# Altium schematic sheet MCU176.SchDoc
size A2
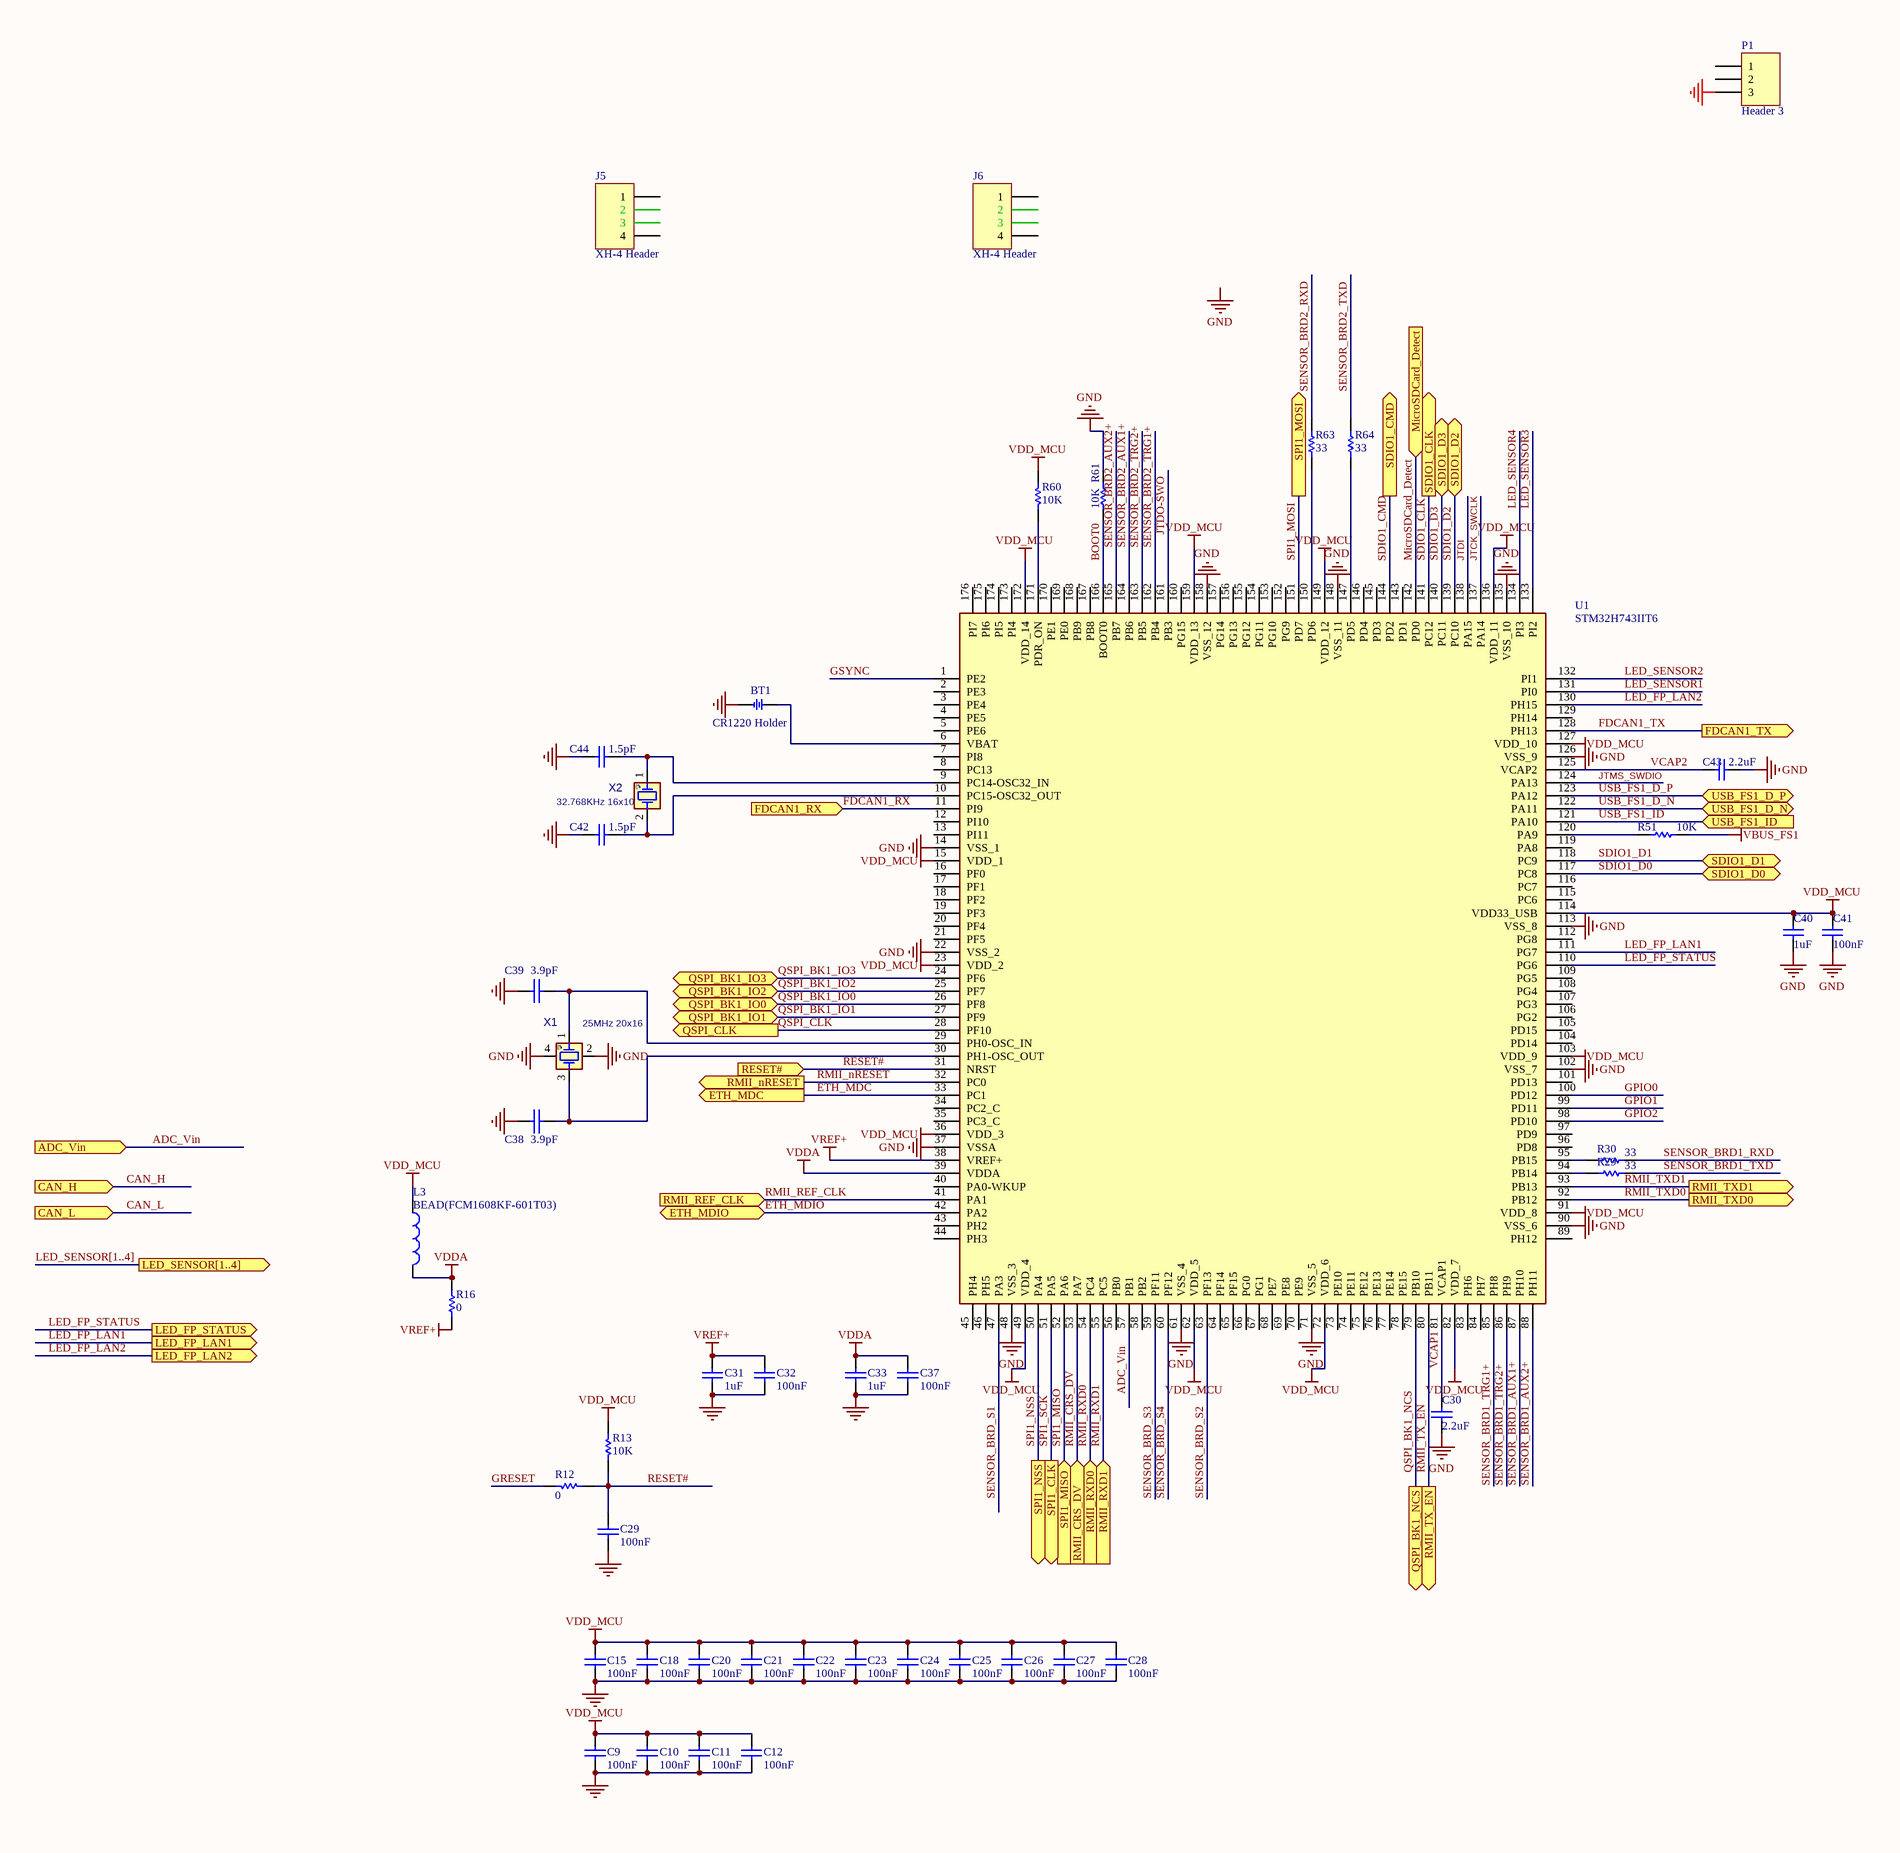
[diagram p0: MCU176.SchDoc, left]
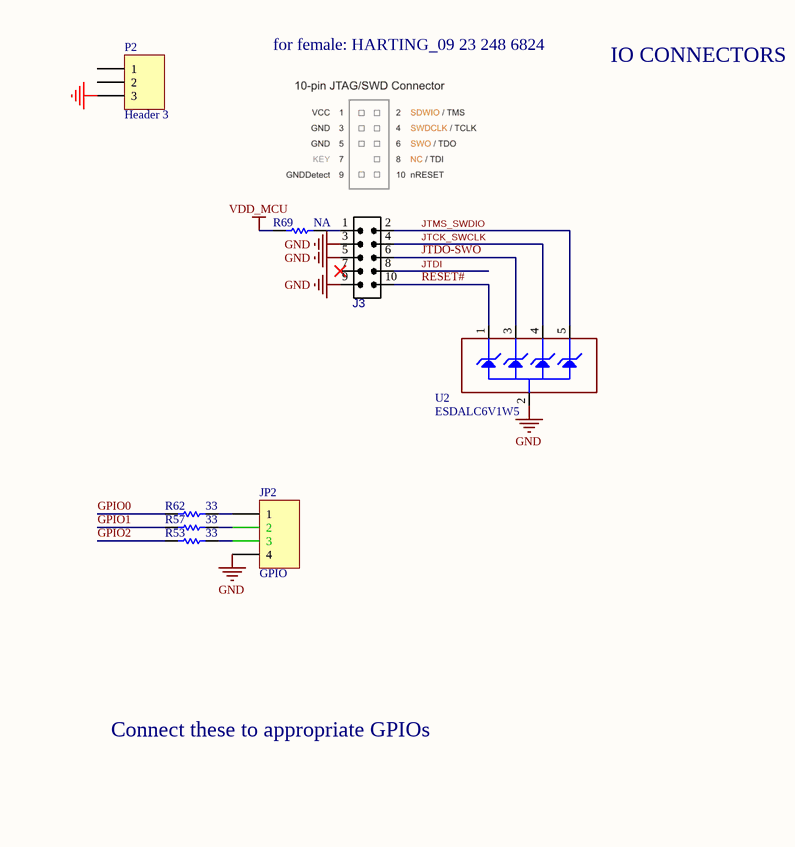
[diagram p1: MCU176.SchDoc, right]

## Parts
BT1  CR1220 Holder  [BTH1220]
C9  100nF  [C0603]
C10  100nF  [C0603]
C11  100nF  [C0603]
C12  100nF  [C0603]
C15  100nF  [C0603]
C18  100nF  [C0603]
C20  100nF  [C0603]
C21  100nF  [C0603]
C22  100nF  [C0603]
C23  100nF  [C0603]
C24  100nF  [C0603]
C25  100nF  [C0603]
C26  100nF  [C0603]
C27  100nF  [C0603]
C28  100nF  [C0603]
C29  100nF  [C0603]
C30  2.2uF  [C0603]
C31  1uF  [C0603]
C32  100nF  [C0603]
C33  1uF  [C0603]
C37  100nF  [C0603]
C38  3.9pF  [C0603]
C39  3.9pF  [C0603]
C40  1uF  [C0603]
C41  100nF  [C0603]
C42  1.5pF  [C0603]
C43  2.2uF  [C0603]
C44  1.5pF  [C0603]
J3  IDC_2X5  [IDC_2X5]  (value not drawn)
J5  XH-4 Header  [XH-4]
J6  XH-4 Header  [XH-4]
JP2  GPIO  [XH-4]
L3  BEAD(FCM1608KF-601T03)  [L0603E]
P1  Header 3  [xh-3]
P2  Header 3  [xh-3]
R12  0  [R0603]
R13  10K  [R0603]
R16  0  [R0603]
R29  33  [R0603]
R30  33  [R0603]
R51  10K  [R0603]
R53  33  [R0603]
R57  33  [R0603]
R60  10K  [R0603]
R61  10K  [R0603]
R62  33  [R0603]
R63  33  [R0603]
R64  33  [R0603]
R69  NA  [R0603]  (no BOM)
U1  STM32H743IIT6  [QFP50P2600X2600X160-176N]
U2  ESDALC6V1W5  [SOT65P210X110-5N]
X1  25MHz 20x16  [XTL_4_2016]
X2  32.768KHz 16x10  [XTL_2_1610]

## Ports
ADC_Vin (in), CAN_H (in), CAN_L (in), ETH_MDC (out), ETH_MDIO (bidir), FDCAN1_RX (in), FDCAN1_TX (out), LED_FP_LAN1 (out), LED_FP_LAN2 (out), LED_FP_STATUS (out), LED_SENSOR[1..4] (out), MicroSDCard_Detect (in), QSPI_BK1_IO0 (bidir), QSPI_BK1_IO1 (bidir), QSPI_BK1_IO2 (bidir), QSPI_BK1_IO3 (bidir), QSPI_BK1_NCS (out), QSPI_CLK (out), RESET# (in), RMII_CRS_DV (in), RMII_nRESET (out), RMII_REF_CLK (in), RMII_RXD0 (in), RMII_RXD1 (in), RMII_TX_EN (out), RMII_TXD0 (out), RMII_TXD1 (out), SDIO1_CLK (out), SDIO1_CMD (out), SDIO1_D0 (bidir), SDIO1_D1 (bidir), SDIO1_D2 (bidir), SDIO1_D3 (bidir), SPI1_CLK (out), SPI1_MISO (in), SPI1_MOSI (out), SPI1_NSS (out), USB_FS1_D_N (bidir), USB_FS1_D_P (bidir), USB_FS1_ID (in)

## Nets
GND: BT1.2 C9.2 C10.2 C11.2 C12.2 C15.2 C18.2 C20.2 C21.2 C22.2 C23.2 C24.2 C25.2 C26.2 C27.2 C28.2 C29.1 C30.1 C31.1 C32.1 C33.1 C37.1 C38.2 C39.2 C40.1 C41.1 C42.2 C43.2 C44.2 J3.3 J3.5 J3.9 JP2.4 P1.3 P2.3 R61.2 U1.14(VSS_1) U1.22(VSS_2) U1.37(VSSA) U1.48(VSS_3) U1.61(VSS_4) U1.71(VSS_5) U1.90(VSS_6) U1.102(VSS_7) U1.113(VSS_8) U1.126(VSS_9) U1.135(VSS_10) U1.148(VSS_11) U1.158(VSS_12) U2.2(GND) X1.2(GND1) X1.4(GND2)
VBUS_FS1: R51.1
VDD_MCU: C9.1 C10.1 C11.1 C12.1 C15.1 C18.1 C20.1 C21.1 C22.1 C23.1 C24.1 C25.1 C26.1 C27.1 C28.1 C40.2 C41.2 L3.1 R13.1 R60.1 R69.2 U1.15(VDD_1) U1.23(VDD_2) U1.36(VDD_3) U1.49(VDD_4) U1.62(VDD_5) U1.72(VDD_6) U1.82(VDD_7) U1.91(VDD_8) U1.103(VDD_9) U1.114(VDD33_USB) U1.127(VDD_10) U1.136(VDD_11) U1.149(VDD_12) U1.159(VDD_13) U1.172(VDD_14)
VDDA: C33.2 C37.2 L3.2 R16.1 U1.39(VDDA)
VREF+: C31.2 C32.2 R16.2 U1.38(VREF+)
ADC_Vin: U1.57(PB1) ; port ADC_Vin
BOOT0: R61.1 U1.166(BOOT0)
CAN_H: port CAN_H
CAN_L: port CAN_L
ETH_MDC: U1.33(PC1) ; port ETH_MDC
ETH_MDIO: U1.42(PA2) ; port ETH_MDIO
FDCAN1_RX: U1.11(PI9) ; port FDCAN1_RX
FDCAN1_TX: U1.128(PH13) ; port FDCAN1_TX
GPIO0: R62.2 U1.100(PD12)
GPIO1: R57.2 U1.99(PD11)
GPIO2: R53.2 U1.98(PD10)
GRESET: R12.1
GSYNC: U1.1(PE2)
JTCK_SWCLK: J3.4 U1.137(PA14) U2.4(IO3)
JTDI: J3.8 U1.138(PA15)
JTDO-SWO: J3.6 U1.161(PB3) U2.3(IO2)
JTMS_SWDIO: J3.2 U1.124(PA13) U2.5(IO4)
LED_FP_LAN1: U1.111(PG7) ; port LED_FP_LAN1
LED_FP_LAN2: U1.130(PH15) ; port LED_FP_LAN2
LED_FP_STATUS: U1.110(PG6) ; port LED_FP_STATUS
LED_SENSOR1: U1.131(PI0)
LED_SENSOR2: U1.132(PI1)
LED_SENSOR3: U1.133(PI2)
LED_SENSOR4: U1.134(PI3)
MicroSDCard_Detect: U1.142(PD0) ; port MicroSDCard_Detect
QSPI_BK1_IO0: U1.26(PF8) ; port QSPI_BK1_IO0
QSPI_BK1_IO1: U1.27(PF9) ; port QSPI_BK1_IO1
QSPI_BK1_IO2: U1.25(PF7) ; port QSPI_BK1_IO2
QSPI_BK1_IO3: U1.24(PF6) ; port QSPI_BK1_IO3
QSPI_BK1_NCS: U1.79(PB10) ; port QSPI_BK1_NCS
QSPI_CLK: U1.28(PF10) ; port QSPI_CLK
RESET#: C29.2 J3.10 R12.2 R13.2 U1.31(NRST) U2.1(IO1) ; port RESET#
RMII_CRS_DV: U1.53(PA7) ; port RMII_CRS_DV
RMII_nRESET: U1.32(PC0) ; port RMII_nRESET
RMII_REF_CLK: U1.41(PA1) ; port RMII_REF_CLK
RMII_RXD0: U1.54(PC4) ; port RMII_RXD0
RMII_RXD1: U1.55(PC5) ; port RMII_RXD1
RMII_TX_EN: U1.80(PB11) ; port RMII_TX_EN
RMII_TXD0: U1.92(PB12) ; port RMII_TXD0
RMII_TXD1: U1.93(PB13) ; port RMII_TXD1
SDIO1_CLK: U1.141(PC12) ; port SDIO1_CLK
SDIO1_CMD: U1.144(PD2) ; port SDIO1_CMD
SDIO1_D0: U1.117(PC8) ; port SDIO1_D0
SDIO1_D1: U1.118(PC9) ; port SDIO1_D1
SDIO1_D2: U1.139(PC10) ; port SDIO1_D2
SDIO1_D3: U1.140(PC11) ; port SDIO1_D3
SENSOR_BRD1_AUX1+: U1.87(PH10)
SENSOR_BRD1_AUX2+: U1.88(PH11)
SENSOR_BRD1_RXD: R30.2
SENSOR_BRD1_TRG1+: U1.85(PH8)
SENSOR_BRD1_TRG2+: U1.86(PH9)
SENSOR_BRD1_TXD: R29.2
SENSOR_BRD2_AUX1+: U1.164(PB6)
SENSOR_BRD2_AUX2+: U1.165(PB7)
SENSOR_BRD2_RXD: R63.1
SENSOR_BRD2_TRG1+: U1.162(PB4)
SENSOR_BRD2_TRG2+: U1.163(PB5)
SENSOR_BRD2_TXD: R64.1
SENSOR_BRD_S1: U1.47(PA3)
SENSOR_BRD_S2: U1.63(PF13)
SENSOR_BRD_S3: U1.59(PF11)
SENSOR_BRD_S4: U1.60(PF12)
SPI1_MISO: U1.52(PA6) ; port SPI1_MISO
SPI1_MOSI: U1.151(PD7) ; port SPI1_MOSI
SPI1_NSS: U1.50(PA4) ; port SPI1_NSS
SPI1_SCK: U1.51(PA5) ; port SPI1_CLK
USB_FS1_D_N: U1.122(PA11) ; port USB_FS1_D_N
USB_FS1_D_P: U1.123(PA12) ; port USB_FS1_D_P
USB_FS1_ID: U1.121(PA10) ; port USB_FS1_ID
VCAP1: C30.2 U1.81(VCAP1)
VCAP2: C43.1 U1.125(VCAP2)
NetBT1_1: BT1.1 U1.6(VBAT)
NetC38_1: C38.1 U1.30(PH1-OSC_OUT) X1.3(XB)
NetC39_1: C39.1 U1.29(PH0-OSC_IN) X1.1(XA)
NetC42_1: C42.1 U1.10(PC15-OSC32_OUT) X2.2(OSC2)
NetC44_1: C44.1 U1.9(PC14-OSC32_IN) X2.1(OSC1)
NetJ3_1: J3.1 R69.1
NetJP2_1: JP2.1 R62.1
NetJP2_2: JP2.2 R57.1
NetJP2_3: JP2.3 R53.1
NetR29_1: R29.1 U1.94(PB14)
NetR30_1: R30.1 U1.95(PB15)
NetR51_2: R51.2 U1.120(PA9)
NetR60_2: R60.2 U1.171(PDR_ON)
NetR63_2: R63.2 U1.150(PD6)
NetR64_2: R64.2 U1.147(PD5)

Not connected (* = marked no-connect by the designer): J3 7*; J5 1 2 3 4; J6 1 2 3 4; P1 1 2; P2 1 2; U1 2(PE3) 3(PE4) 4(PE5) 5(PE6) 7(PI8) 8(PC13) 12(PI10) 13(PI11) 16(PF0) 17(PF1) 18(PF2) 19(PF3) 20(PF4) 21(PF5) 34(PC2_C) 35(PC3_C) 40(PA0-WKUP) 43(PH2) 44(PH3) 45(PH4) 46(PH5) 56(PB0) 58(PB2) 64(PF14) 65(PF15) 66(PG0) 67(PG1) 68(PE7) 69(PE8) 70(PE9) 73(PE10) 74(PE11) 75(PE12) 76(PE13) 77(PE14) 78(PE15) 83(PH6) 84(PH7) 89(PH12) 96(PD8) 97(PD9) 101(PD13) 104(PD14) 105(PD15) 106(PG2) 107(PG3) 108(PG4) 109(PG5) 112(PG8) 115(PC6) 116(PC7) 119(PA8) 129(PH14) 143(PD1) 145(PD3) 146(PD4) 152(PG9) 153(PG10) 154(PG11) 155(PG12) 156(PG13) 157(PG14) 160(PG15) 167(PB8) 168(PB9) 169(PE0) 170(PE1) 173(PI4) 174(PI5) 175(PI6) 176(PI7)

## Buses and harness runs
bus LED_SENSOR[1..4] = port LED_SENSOR[1..4]

## Notes on the sheet
- for female: HARTING_09 23 248 6824
- IO CONNECTORS
- Connect these to appropriate GPIOs
- Labels drawn without touching a wire or pin: GND

## Library data of the parts
BT1 = BATH_CR1220: BATTERY HOLDER, CR1220; VALUE: BAT3volt; MANF_P#: -; .: http://www.chila.ir
C9-C12 C15 C18 C20-C28 C38 C39 = CAP
  C9-C12 C15 C18 C20-C28: Published: 8-Jun-2000; Revision: July-2002: Re-released for DXP Platform.; Publisher: Altium Limited; Value: 100nF
C29 = CAP: Value: 100pF; Published: 8-Jun-2000; Revision: July-2002: Re-released for DXP Platform.; Publisher: Altium Limited
C30-C33 C37 C40 C41 C43 = Cap: Value: 10nF; Published: 8-Jun-2000; Revision: July-2002: Re-released for DXP Platform.; Publisher: Altium Limited
C42 C44 = Capacitor_ST: Value: 100nF; Revision: July-2002: Re-released for DXP Platform.
J3 = IDC_2X5: CONN, IDC, Male, pitch: 2.54mm, 10POS; VALUE: IDC_2X5
J5 J6 JP2 = Header 4: CONN HEADER 4POS 2.54MM VERT T/H MALE; Manufacturer: TE Connectivity; Current Footprint: THD-4P; Assembly Status: A; Connector NAME: Camera; PCB Project: FL3 Controller
L3 = Inductor: Value: 100uH; Published: 8-Jun-2000; Revision: July-2002: Re-released for DXP Platform.; Publisher: Altium Limited
P1 P2 = Header 3: Header, 3-Pin; LatestRevisionDate: 17-Jul-2002; LatestRevisionNote: Re-released for DXP Platform.; Publisher: Altium Limited
R12 R13 R16 R29 R30 R51 R53 R57 R60 R62-R64 R69 = Res1: Value: 1K; Published: 8-Jun-2000; Revision: July-2002: Re-released for DXP Platform.; Publisher: Altium Limited
R61 = res1: Value: 1K; Published: 8-Jun-2000; Revision: July-2002: Re-released for DXP Platform.; Publisher: Altium Limited
U1 = STM32H743IIT6: Integrated Circuit; Manufacturer_Name: STMicroelectronics; Datasheet Link: https://componentsearchengine.com/Datasheets/1/STM32H743IIT6.pdf; Height: 1.6mm; Manufacturer_Part_Number: STM32H743IIT6; Mouser Part Number: 511-STM32H743IIT6; Mouser Price/Stock: https://www.mouser.co.uk/ProductDetail/STMicroelectronics/STM32H743IIT6?qs=FNcb6ahWXRzE163cq8Rfjg%3D%3D; Arrow Part Number: STM32H743IIT6; Arrow Price/Stock: https://www.arrow.com/en/products/stm32h743iit6/stmicroelectronics?region=nac
U2 = ESDALC6V1W5: Dual Transil array for ESD protection; Manuf_1: STM; Manuf_Part_1: ESDA5V3L; Ref St: 9179034; Provided: ST; ECCN_US/EU: EAR99/NEC; Distrib: ST; Order: ESDA5V3L; Ordered by: STM
X1 = XTL_4_25MHz_3225: CRYSTAL; PARAM: 10PPM; DESC: DESCRIPTION; DIST#: MOUSER; PARAM2: PARAM; MANF_P#: XRCGB25M000F1H00R0; MANF: -; ASSEMBLY: ASSEMBLY; PRICE: 0.5$; VALUE: 25MHz 20x16
X2 = XTL_2_32.768_3215A: Crystal; MANF_P#: ABS05-32.768KHZ-9-T; PARAM2: 7pF, 20PPM; PARAM: -40~85oC; MANF: -; PRICE: 1$; VALUE: 32.768KHz 16x10